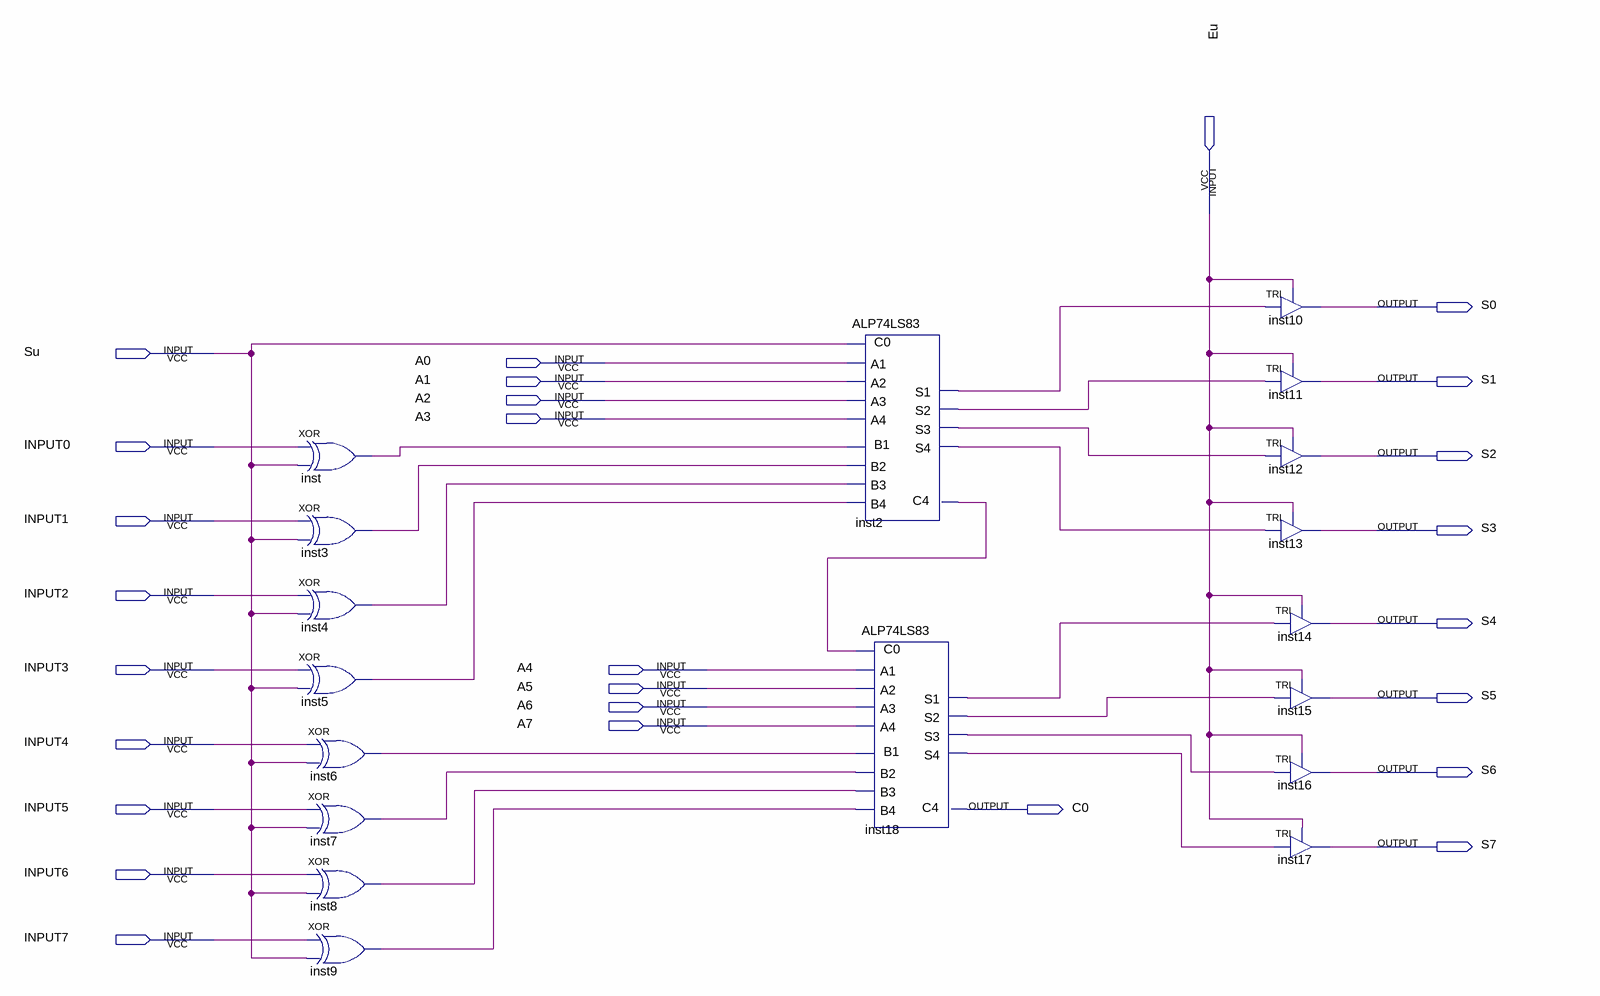
[diagram p0: schematic sheet]
// Quartus schematic SomadorSubtrator.bdf as structural Verilog: 18 symbols, 27 pins
module SomadorSubtrator (
  input  Eu,
  input  Su,
  input  A0,
  input  A1,
  input  A2,
  input  A3,
  input  INPUT0,
  input  INPUT1,
  input  INPUT2,
  input  INPUT3,
  input  A4,
  input  A5,
  input  A6,
  input  A7,
  input  INPUT4,
  input  INPUT5,
  input  INPUT6,
  input  INPUT7,
  output S0,
  output S1,
  output S2,
  output S3,
  output S4,
  output S5,
  output S6,
  output C0,
  output S7
);

  wire inst2_c4, inst2_s1, inst2_s2, inst2_s3, inst2_s4, inst3_out, inst4_out, inst5_out, inst6_out,
       inst7_out, inst8_out, inst9_out, inst18_s1, inst18_s2, inst18_s3, inst18_s4, inst_out;

  xor inst (inst_out, INPUT0, Su);
  xor inst3 (inst3_out, INPUT1, Su);
  xor inst4 (inst4_out, INPUT2, Su);
  xor inst5 (inst5_out, INPUT3, Su);
  xor inst6 (inst6_out, INPUT4, Su);
  xor inst7 (inst7_out, INPUT5, Su);
  xor inst8 (inst8_out, INPUT6, Su);
  xor inst9 (inst9_out, INPUT7, Su);
  ALP74LS83 inst2 (
    .C0(Su), .A1(A0), .B1(inst_out), .A2(A1), .B2(inst3_out), .A3(A2), .B3(inst4_out), .A4(A3),
    .B4(inst5_out), .C4(inst2_c4), .S4(inst2_s4), .S3(inst2_s3), .S2(inst2_s2), .S1(inst2_s1));
  ALP74LS83 inst18 (
    .C0(inst2_c4), .A1(A4), .B1(inst6_out), .A2(A5), .B2(inst7_out), .A3(A6), .B3(inst8_out), .A4(A7),
    .B4(inst9_out), .C4(C0), .S4(inst18_s4), .S3(inst18_s3), .S2(inst18_s2), .S1(inst18_s1));
  TRI inst10 (.IN(inst2_s1), .OE(Eu), .OUT(S0));
  TRI inst11 (.IN(inst2_s2), .OE(Eu), .OUT(S1));
  TRI inst12 (.IN(inst2_s3), .OE(Eu), .OUT(S2));
  TRI inst13 (.IN(inst2_s4), .OE(Eu), .OUT(S3));
  TRI inst14 (.IN(inst18_s1), .OE(Eu), .OUT(S4));
  TRI inst15 (.IN(inst18_s2), .OE(Eu), .OUT(S5));
  TRI inst16 (.IN(inst18_s3), .OE(Eu), .OUT(S6));
  TRI inst17 (.IN(inst18_s4), .OE(Eu), .OUT(S7));
endmodule
